# EAGLE design rtc (EAGLE 9.6.2)
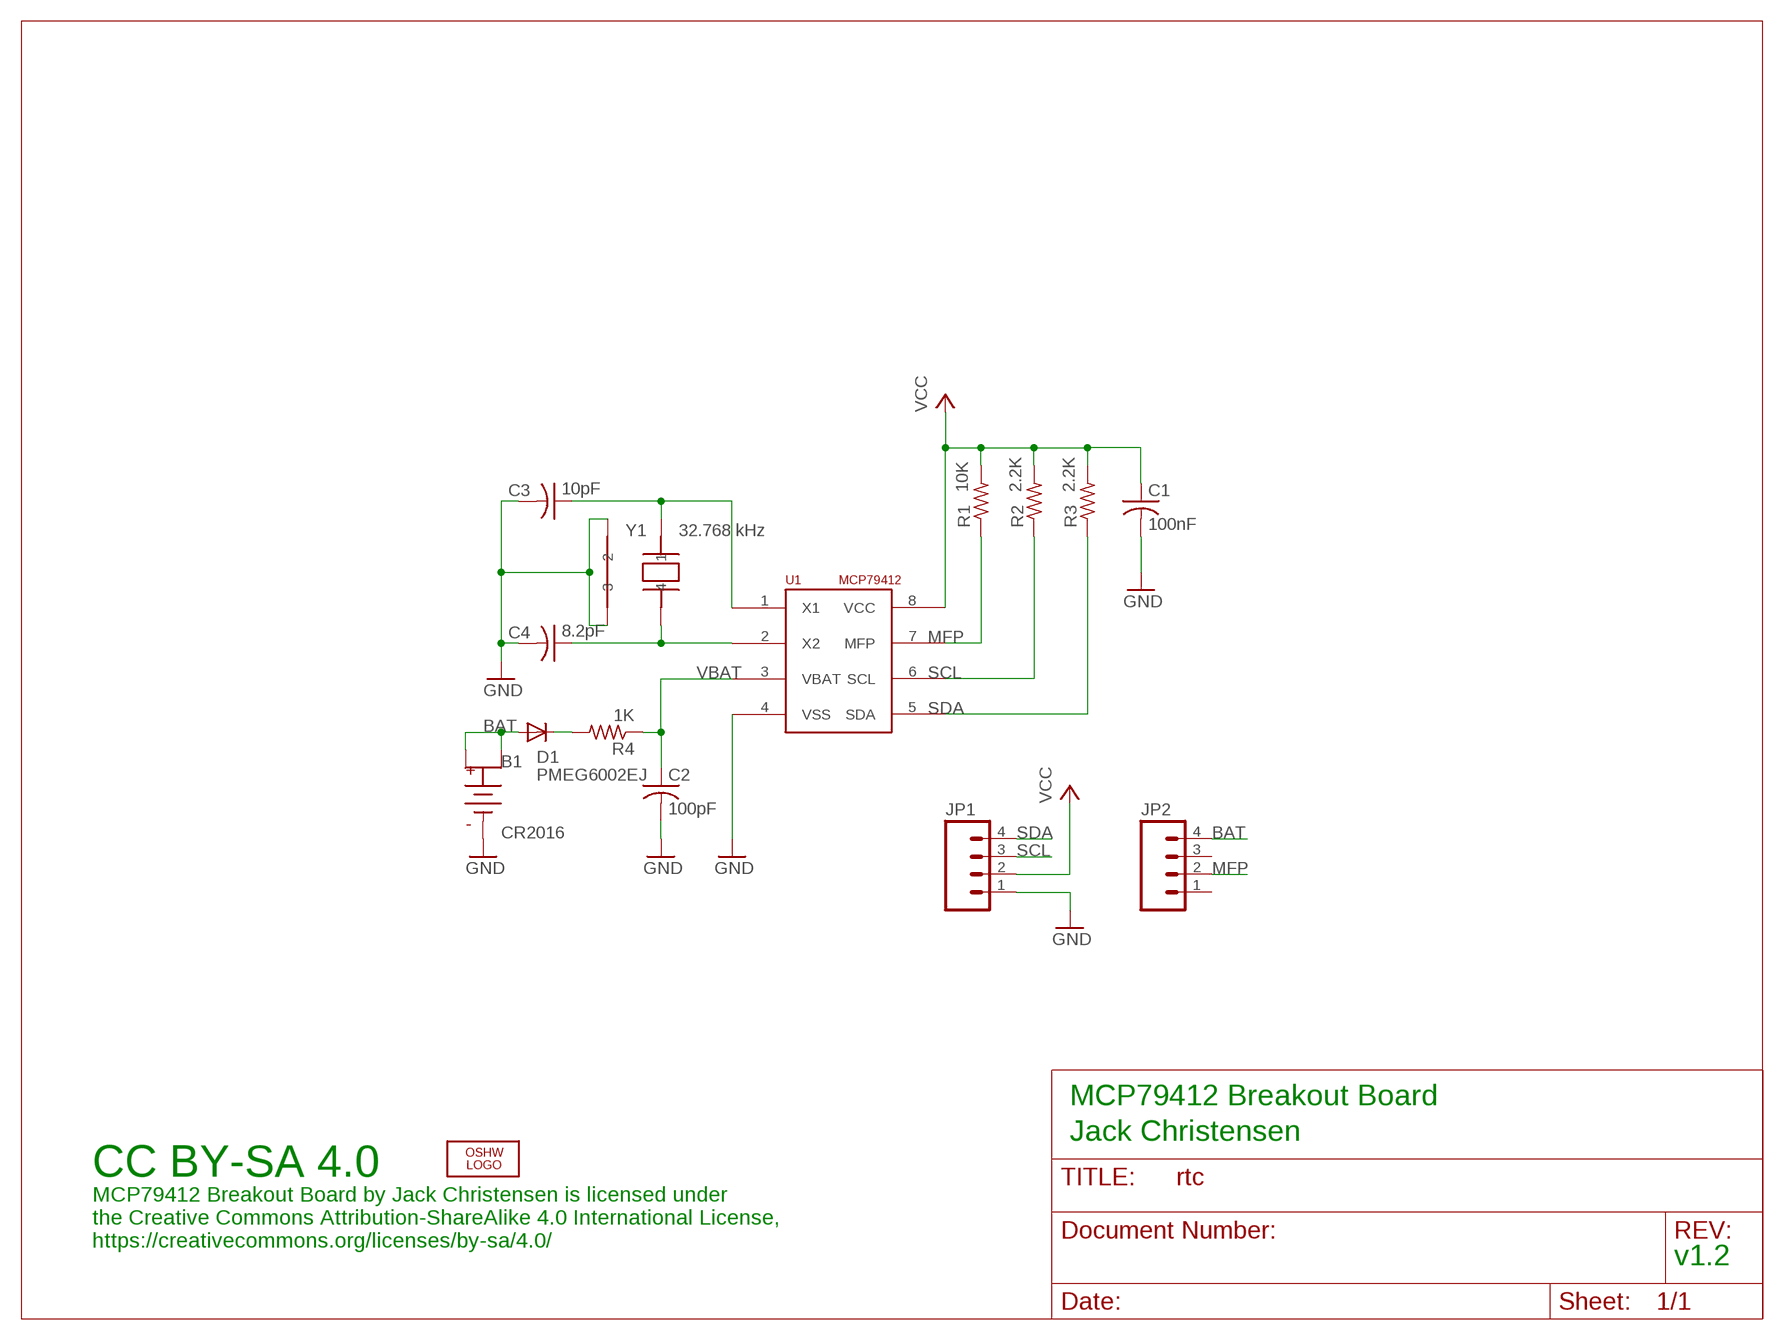
[diagram p0: schematic, sheet 1]

## Parts
B1  CR2016  COIN-CELL-2016-SMT  [BAT-HLD-002-SMT]
C1  100nF  C-USM0805  [M0805]
C2  100pF  C-USM0805  [M0805]
C3  10pF  C-USM0805  [M0805]
C4  8.2pF  C-USM0805  [M0805]
D1  PMEG6002EJ  DIODESOD-323F-A  [SOD-323F-A]
JP1  M04LOCK  [1X04_LOCK]
JP2  M04LOCK  [1X04_LOCK]
LOGO2  OSHW_LOGO_8MILX0150-NT  [OSHW_8X150_NOTEXT]
R1  10K  R-US_M0805  [M0805]
R2  2.2K  R-US_M0805  [M0805]
R3  2.2K  R-US_M0805  [M0805]
R4  1K  R-US_M0805  [M0805]
U1  MCP79412  MCP7941X-SOIC-8  [SO08]
Y1  32.768 kHz  CRYSTAL-CITIZEN-CM2XXC  [CRYSTAL-CITIZEN-CM2XXC]

## Nets
BAT: B1.POS1 B1.POS2 D1.A JP2.4
GND: B1.NEG(B-) C1.2 C2.2 C3.2 C4.2 JP1.1 U1.4(VSS) Y1.P$2 Y1.P$3
MFP: JP2.2 R1.1 U1.7(MFP)
N$1: D1.K R4.2
N$2: C4.1 U1.2(X2) Y1.P$4
N$3: C3.1 U1.1(X1) Y1.P$1
SCL: JP1.3 R2.1 U1.6(SCL)
SDA: JP1.4 R3.1 U1.5(SDA)
VBAT: C2.1 R4.1 U1.3(VBAT)
VCC: C1.1 JP1.2 R1.2 R2.2 R3.2 U1.8(VCC)
Unconnected: JP2.1 JP2.3

## Notes on the sheet
- MCP79412 Breakout Board
- Jack Christensen
- CC BY-SA 4.0
- MCP79412 Breakout Board by Jack Christensen is licensed under
  the Creative Commons Attribution-ShareAlike 4.0 International License,
  https://creativecommons.org/licenses/by-sa/4.0/
- v1.2

## Library data of the parts
B1 = _jc:COIN-CELL
C1-C4 = _jc:C-US: CAPACITOR, American symbol
D1 = _jc:DIODE
JP1 JP2 = SparkFun:M04: Header 4 Standard 4-pin 0.1" header. Use with straight break away headers (SKU : PRT-00116), right angle break away headers (PRT-00553), swiss pins (PRT-00743), machine pins (PRT-00117), and female headers (PRT-00115). Molex polarized connector foot print use with SKU : PRT-08231 with associated crimp pins and housings.
LOGO2 = ohw-logo:OSHW_LOGO_8MIL
R1-R4 = _jc:R-US_: RESISTOR, American symbol
U1 = _jc:MCP7941X
Y1 = _jc:CRYSTAL-CITIZEN-CM2XXC

## Board
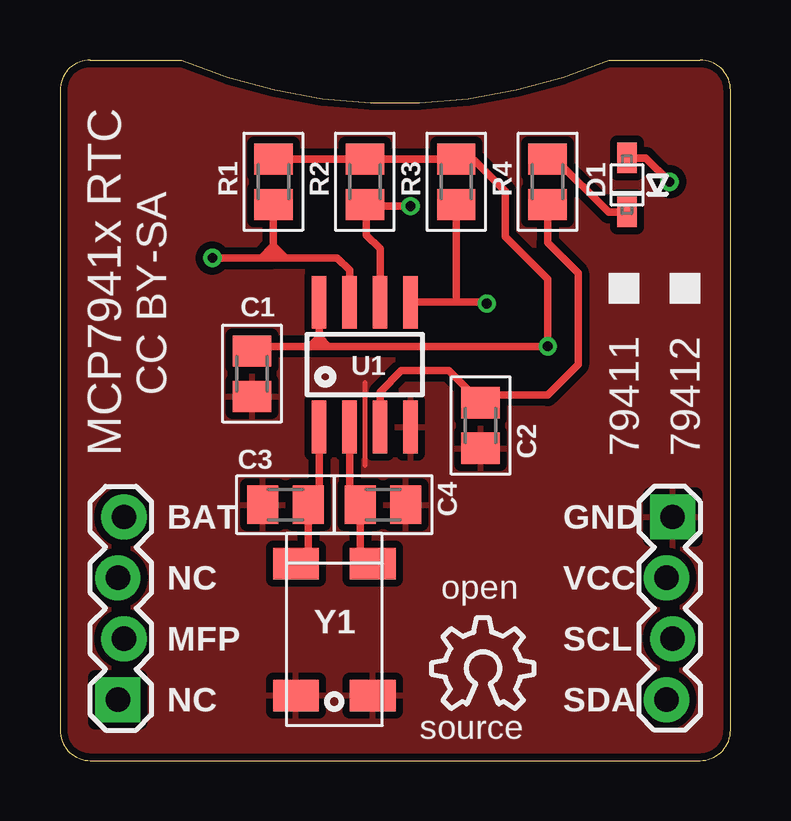
[diagram p1: board, top side]
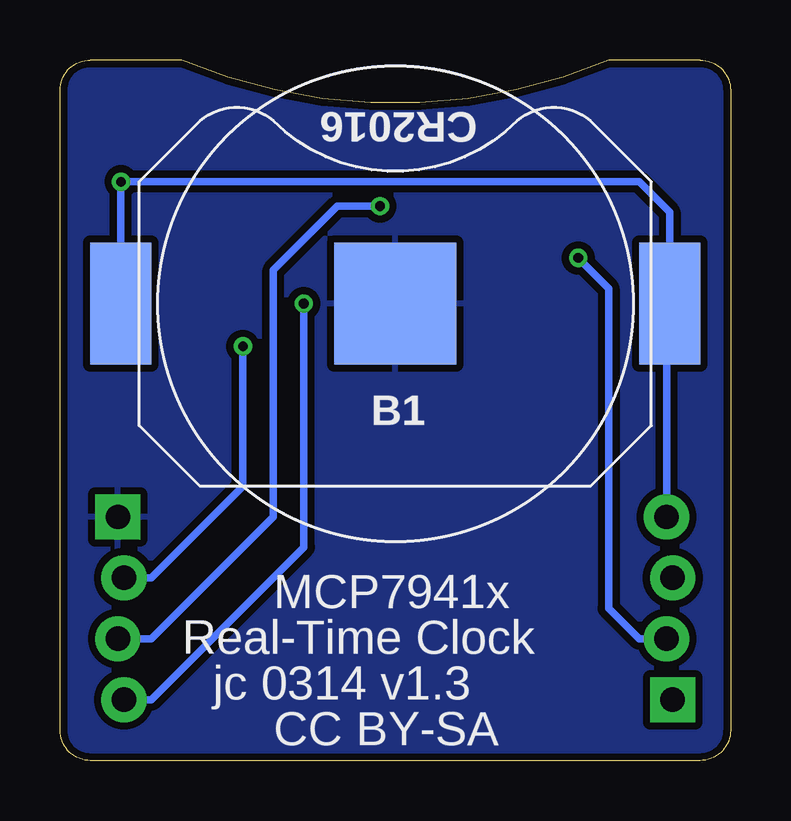
[diagram p2: board, bottom side, seen from below]

Size 27.94 x 29.21 mm. Coordinates in mm from the lower left corner, seen from the top.
Outline: 0,27.94 0,1.27 arc90 1.27,0 26.67,0 arc90 27.94,1.27 27.94,27.94 arc90 26.67,29.21 22.86,29.21 arc-46 5.08,29.21 1.27,29.21 arc90 0,27.94
Copper layers (1*16): Top 0.0356mm / dielectric 1.5011mm / Bottom 0.0356mm
Design rules "oshpark-2layer-jc": minimum track width 8mil, minimum drill 13mil, track to track 8mil, track to pad 8mil, pad to pad 8mil, via to via 8mil, smd to smd 6mil, copper to edge 12mil, drill to drill 6mil, minimum pad ring 7mil, minimum via ring 7mil, stop-mask expansion 2.5mil, vias tented up to drill 20mil, thermal gap 12mil

### Footprints (pad centres in the part's own frame; a part is rotated, then mirrored left to right if it is on the bottom)
BAT-HLD-002-SMT = smd 5.08 x 5.08: NEG 0,0 | smd 2.54 x 5.08: POS1 -11.43,0; POS2 11.43,0
M0805 = smd 1.3 x 1.6: 1 -0.95,0; 2 0.95,0
SOD-323F-A = smd 1.27 x 0.813: A -1.118,0; K 1.118,0
1X04_LOCK = drill 1.016 pad 1.88 square: 1 0,0.127 | drill 1.016 pad 1.88: 2 2.54,-0.127; 3 5.08,0.127; 4 7.62,-0.127
SO08 = smd 0.6 x 2.2: 1 -1.905,-2.6; 2 -0.635,-2.6; 3 0.635,-2.6; 4 1.905,-2.6; 5 1.905,2.6; 6 0.635,2.6; 7 -0.635,2.6; 8 -1.905,2.6
CRYSTAL-CITIZEN-CM2XXC = smd 1.3 x 1.9: P$1 -2.75,-1.6; P$2 2.75,-1.6; P$3 2.75,1.6; P$4 -2.75,1.6

### Placement (x,y rotation side)
B1  13.97,19.05 180 bottom
C1  8,16.13 270 top
C2  17.53,13.97 270 top
C3  9.4,10.67 180 top
C4  13.46,10.67 0 top
D1  23.62,24 270 top
JP1  25.4,10.16 270 top
JP2  2.54,2.54 90 top
LOGO2  15.49,2.16 0 top
R1  8.89,24.13 90 top
R2  12.7,24.13 90 top
R3  16.51,24.13 90 top
R4  20.32,24.13 90 top
U1  12.7,16.51 0 top
Y1  11.43,5.46 270 top

### Tracks (layer width: path | path; a pad name or v marks a point on that pad's centre or on a via)
BAT  (via drill 0.41)
  Top 0.305: D1.A 24.41,25.12 v25.4,24.13
  Bottom 0.305: JP2.4 2.67,18.92 2.54,18.92 B1.POS1 2.54,22.86 3.81,24.13 v25.4,24.13 B1.POS2
GND
  Top 0.203: 12.7,15.75 12.7,12.32
  pour Bottom (isolate 0.305): -1.27,31.75 33.02,31.75 33.02,-2.54 -1.27,-2.54
  pour Top (isolate 0.305): -2.54,-3.81 33.02,-3.81 33.02,31.75 -2.54,31.75
MFP  (via drill 0.41)
  Top 0.305: R1.1 9.27,22.8 8.95,22.8 8.89,22.86 8.89,21.46 | U1.7 12.06,20.45 11.56,20.96 9.4,20.96 | 9.4,20.96 8.89,20.96 | 8.89,21.46 8.89,20.96 | v6.35,20.96 8.38,20.96 | 8.38,20.96 8.89,20.96 | 8.89,21.46 8.38,20.96 | 8.89,21.46 9.4,20.96
  Bottom 0.305: v6.35,20.96 5.08,19.68 5.08,6.35 3.81,5.08 JP2.2
N$1
  Top 0.305: R4.2 20.64,25.08 22.86,22.86 23.6,22.86 D1.K
N$2
  Top 0.305: U1.2 12.06,11.12 C4.1 12.51,8.73 Y1.P$4
N$3
  Top 0.305: U1.1 10.79,11.12 C3.1 10.35,8.73 Y1.P$1
SCL  (via drill 0.41)
  Top 0.305: v14.61,23.11 12.77,23.11 | 12.77,23.11 R2.1 | 12.77,23.11 12.77,21.91 13.34,21.34 U1.6
  Bottom 0.305: v14.61,23.11 16.38,23.11 19.05,20.45 19.05,10.16 24.13,5.08 JP1.3
SDA  (via drill 0.41)
  Top 0.305: R3.1 16.51,19.56 16.51,19.13 | v17.78,19.05 17.7,19.13 16.51,19.13 | 16.51,19.13 14.61,19.13 U1.5
  Bottom 0.305: JP1.4 24.13,2.54 17.78,8.89 v17.78,19.05
VBAT
  Top 0.305: R4.1 20.32,21.59 21.59,20.32 21.59,16.51 20.32,15.24 17.85,15.24 C2.1 16.19,16.26 14.22,16.26 13.34,15.37 U1.3
VCC  (via drill 0.41)
  Top 0.305: R1.2 R2.2 R3.2 16.57,25.02 17.27,25.02 18.54,23.75 18.54,21.84 20.32,20.07 v20.32,17.27 11.18,17.27 | 11.18,17.27 10.79,17.27 | 10.79,17.27 10.41,17.27 | 10.41,17.27 8.19,17.27 C1.1 | U1.8 10.79,17.65 | 10.79,17.65 10.79,17.27 | 10.79,17.65 10.41,17.27 | 10.79,17.65 11.18,17.27
  Bottom 0.305: JP1.2 24.13,7.62 20.32,11.43 v20.32,17.27

### Text on the board
tPlace: CC BY-SA | MCP7941x RTC | 79411 | 79412 | BAT | GND | NC | open | VCC | MFP | SCL | NC | SDA | source
bPlace: MCP7941x | Real-Time Clock | jc 0314 v1.3 | CC BY-SA